# Altium schematic sheet triggerbox.SchDoc
size A3
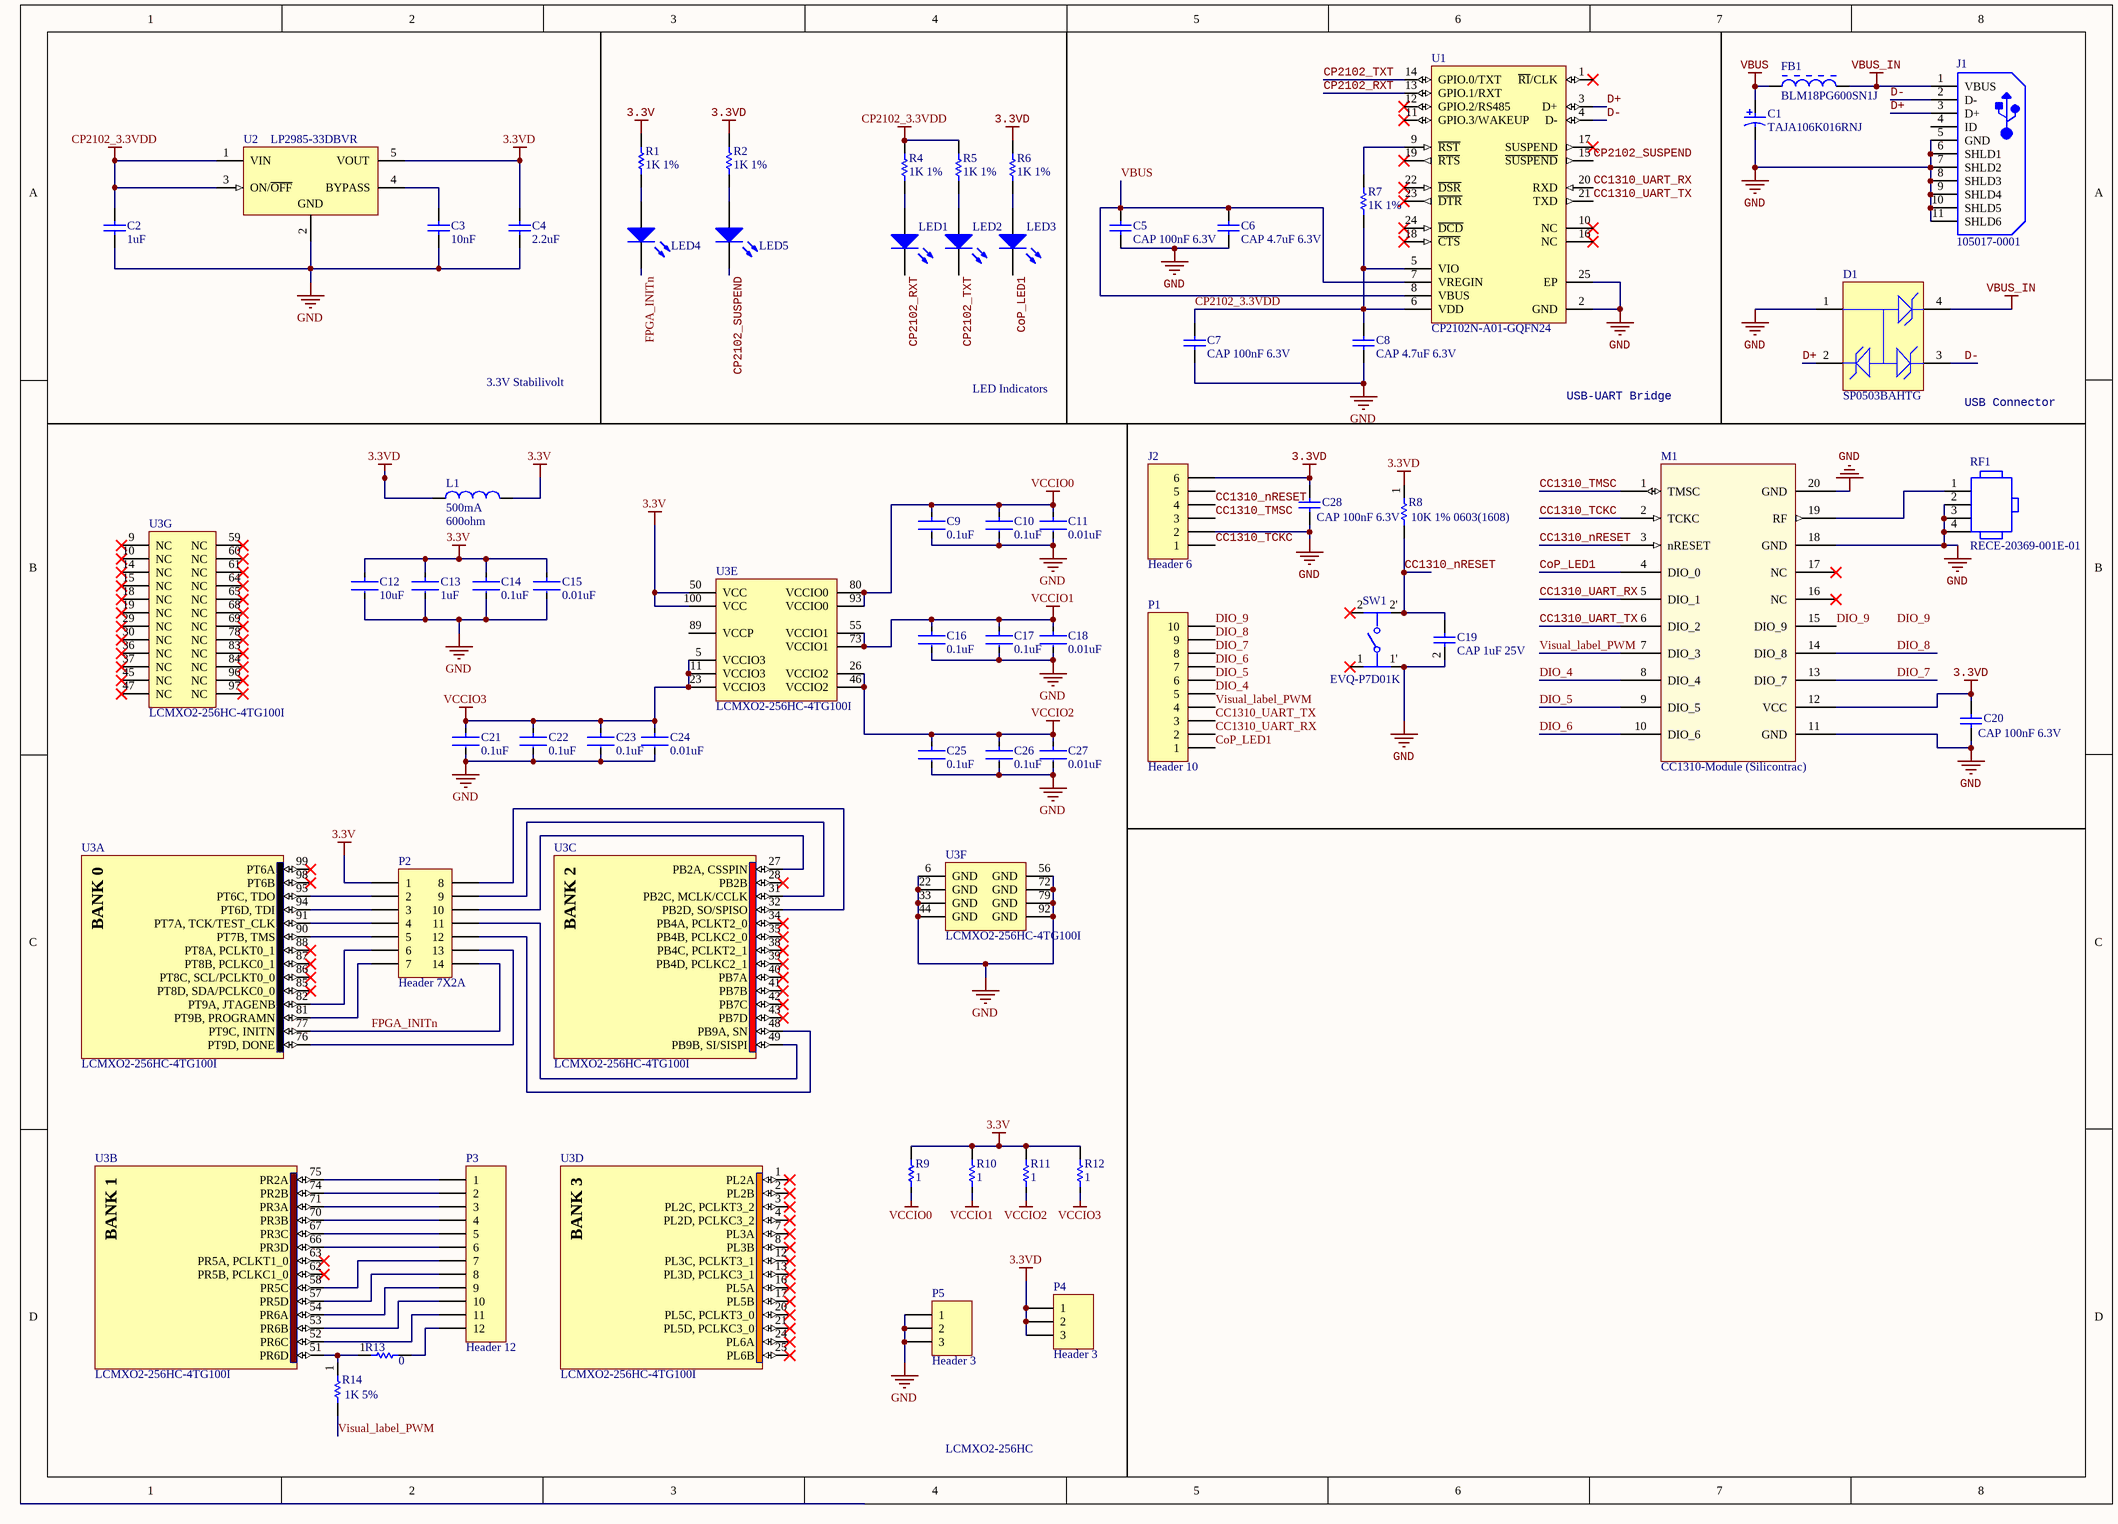
[diagram p0: triggerbox.SchDoc]

## Parts
C1  TAJA106K016RNJ  [CAPMP3217X18-T_V]
C2  1uF  [CAPC0603(1608)55_N]
C3  10nF  [CAPC0603(1608)55_N]
C4  2.2uF  [CAPC0603(1608)55_N]
C5  CAP 100nF 6.3V  [CAPC0603(1608)100_N]
C6  CAP 4.7uF 6.3V  [CAPC0603(1608)100_N]
C7  CAP 100nF 6.3V  [CAPC0603(1608)100_N]
C8  CAP 4.7uF 6.3V  [CAPC0603(1608)100_N]
C9  0.1uF  [FP-GRM155-0_05-IPC_A]
C10  0.1uF  [FP-GRM155-0_05-IPC_A]
C11  0.01uF  [FP-GRM155-0_05-IPC_A]
C12  10uF  [FP-GRM155-0_05-IPC_A]
C13  1uF  [FP-GRM155-0_05-IPC_A]
C14  0.1uF  [FP-GRM155-0_05-IPC_A]
C15  0.01uF  [FP-GRM155-0_05-IPC_A]
C16  0.1uF  [FP-GRM155-0_05-IPC_A]
C17  0.1uF  [FP-GRM155-0_05-IPC_A]
C18  0.01uF  [FP-GRM155-0_05-IPC_A]
C19  CAP 1uF 25V  [CAPC0603(1608)100_N]
C20  CAP 100nF 6.3V  [CAPC0603(1608)100_N]
C21  0.1uF  [FP-GRM155-0_05-IPC_A]
C22  0.1uF  [FP-GRM155-0_05-IPC_A]
C23  0.1uF  [FP-GRM155-0_05-IPC_A]
C24  0.01uF  [FP-GRM155-0_05-IPC_A]
C25  0.1uF  [FP-GRM155-0_05-IPC_A]
C26  0.1uF  [FP-GRM155-0_05-IPC_A]
C27  0.01uF  [FP-GRM155-0_05-IPC_A]
C28  CAP 100nF 6.3V  [CAPC0603(1608)100_N]
D1  SP0503BAHTG  [LFUS-SOT143-4_V]
FB1  BLM18PG600SN1J  [MURA-BLM18PG_KG-CHIP-2_V2]
J1  105017-0001  [USB-MICRO-B_V]
J2  Header 6  [GH-1.25-WS-6P]
L1  500mA  value 600ohm  [0402-A]
LED1  150060BS75000  [0603_A]  (value not drawn)
LED2  150060BS75000  [0603_A]  (value not drawn)
LED3  150060BS75000  [0603_A]  (value not drawn)
LED4  150060BS75000  [0603_A]  (value not drawn)
LED5  150060BS75000  [0603_A]  (value not drawn)
M1  CC1310-Module (Silicontrac)  [CC1310ZTR4-GC]
P1  Header 10  [HDR1X10]
P2  Header 7X2A  [HDR2X7_CEN]
P3  Header 12  [HDR1X12]
P4  Header 3  [HDR1X3]
P5  Header 3  [HDR1X3]
R1  1K 1%  [RESC0603(1608)_N]
R2  1K 1%  [RESC0603(1608)_N]
R4  1K 1%  [RESC0603(1608)_N]
R5  1K 1%  [RESC0603(1608)_N]
R6  1K 1%  [RESC0603(1608)_N]
R7  1K 1%  [RESC0603(1608)_N]
R8  10K 1% 0603(1608)  [RESC0603(1608)_N]
R9  1  [RESC0603(1608)_N]
R10  1  [RESC0603(1608)_N]
R11  1  [RESC0603(1608)_N]
R12  1  [RESC0603(1608)_N]
R13  0  [RESC0603(1608)_N]
R14  1K 5%  [RESC0603(1608)_N]
RF1  RECE-20369-001E-01  [IPEX_MHF_I]
SW1  EVQ-P7D01K  [FP-EVQ-P7D01K-MFG]
U1  CP2102N-A01-GQFN24  [SLAB-QFN-24-2550x2550TP_A_V]
U2  LP2985-33DBVR  [DBV0005A_M]
U3  LCMXO2-256HC-4TG100I  [TQFP100_N]  (parts A,B,C,D,E,F,G of 7)

## Nets
3.3V: C12.1 C13.1 C14.1 C15.1 L1.2 P2.1 R1.2 R9.2 R10.2 R11.2 R12.2 U3.50(VCC) U3.100(VCC)
3.3VD: C4.2 C20.2 C28.2 J2.6 L1.1 M1.12(VCC) P4.1 P4.2 P4.3 R2.2 R6.2 R8.1 U2.5(VOUT)
CP2102_3.3VDD: C2.2 C7.2 C8.2 R4.2 R5.2 R7.1 U1.5(VIO) U1.6(VDD) U2.1(VIN) U2.3(ON/~{OFF})
GND: C1.2 C2.1 C3.1 C4.1 C5.1 C6.1 C7.1 C8.1 C9.2 C10.2 C11.2 C12.2 C13.2 C14.2 C15.2 C16.2 C17.2 C18.2 C19.2 C20.1 C21.2 C22.2 C23.2 C24.2 C25.2 C26.2 C27.2 C28.1 D1.1 J1.5(GND) J1.6(SHLD1) J1.7(SHLD2) J1.8(SHLD3) J1.9(SHLD4) J1.10(SHLD5) J1.11(SHLD6) J2.2 M1.11(GND) M1.18(GND) M1.20(GND) P5.1 P5.2 P5.3 RF1.2 RF1.3 RF1.4 SW1.1' U1.2(GND) U1.25(EP) U2.2(GND) U3.6(GND) U3.22(GND) U3.33(GND) U3.44(GND) U3.56(GND) U3.72(GND) U3.79(GND) U3.92(GND)
VBUS: C1.1 C5.2 C6.2 FB1.1 U1.7(VREGIN) U1.8(VBUS)
VBUS_IN: D1.4 FB1.2 J1.1(VBUS)
VCCIO0: C9.1 C10.1 C11.1 R9.1 U3.80(VCCIO0) U3.93(VCCIO0)
VCCIO1: C16.1 C17.1 C18.1 R10.1 U3.55(VCCIO1) U3.73(VCCIO1)
VCCIO2: C25.1 C26.1 C27.1 R11.1 U3.26(VCCIO2) U3.46(VCCIO2)
VCCIO3: C21.1 C22.1 C23.1 C24.1 R12.1 U3.5(VCCIO3) U3.11(VCCIO3) U3.23(VCCIO3)
CC1310_nRESET: C19.1 J2.4 M1.3(nRESET) R8.2 SW1.2'
CC1310_TCKC: J2.1 M1.2(TCKC)
CC1310_TMSC: J2.3 M1.1(TMSC)
CC1310_UART_RX: M1.5(DIO_1) P1.2 U1.20(RXD)
CC1310_UART_TX: M1.6(DIO_2) P1.3 U1.21(TXD)
CoP_LED1: LED3.1(K) M1.4(DIO_0) P1.1
CP2102_RXT: LED1.1(K) U1.13(GPIO.1/RXT)
CP2102_SUSPEND: LED5.1(K) U1.15(~{SUSPEND})
CP2102_TXT: LED2.1(K) U1.14(GPIO.0/TXT)
D+: D1.2 J1.3(D+) U1.3(D+)
D-: D1.3 J1.2(D-) U1.4(D-)
DIO_4: M1.8(DIO_4) P1.5
DIO_5: M1.9(DIO_5) P1.6
DIO_6: M1.10(DIO_6) P1.7
DIO_7: M1.13(DIO_7) P1.8
DIO_8: M1.14(DIO_8) P1.9
DIO_9: M1.15(DIO_9) P1.10
FPGA_INITn: LED4.1(K) P2.14 U3.77(PT9C,_INITN)
Visual_label_PWM: M1.7(DIO_3) P1.4 R14.2
NetC3_2: C3.2 U2.4(BYPASS)
NetLED1_2: LED1.2(A) R4.1
NetLED2_2: LED2.2(A) R5.1
NetLED3_2: LED3.2(A) R6.1
NetLED4_2: LED4.2(A) R1.1
NetLED5_2: LED5.2(A) R2.1
NetM1_19: M1.19(RF) RF1.1
NetP2_2: P2.2 U3.95(PT6C,_TDO)
NetP2_3: P2.3 U3.94(PT6D,_TDI)
NetP2_4: P2.4 U3.91(PT7A,_TCK/TEST_CLK)
NetP2_5: P2.5 U3.90(PT7B,_TMS)
NetP2_6: P2.6 U3.82(PT9A,_JTAGENB)
NetP2_7: P2.7 U3.81(PT9B,_PROGRAMN)
NetP2_8: P2.8 U3.32(PB2D,_SO/SPISO)
NetP2_9: P2.9 U3.31(PB2C,_MCLK/CCLK)
NetP2_10: P2.10 U3.27(PB2A,_CSSPIN)
NetP2_11: P2.11 U3.49(PB9B,_SI/SISPI)
NetP2_12: P2.12 U3.48(PB9A,_SN)
NetP2_13: P2.13 U3.76(PT9D,_DONE)
NetP3_1: P3.1 U3.75(PR2A)
NetP3_2: P3.2 U3.74(PR2B)
NetP3_3: P3.3 U3.71(PR3A)
NetP3_4: P3.4 U3.70(PR3B)
NetP3_5: P3.5 U3.67(PR3C)
NetP3_6: P3.6 U3.66(PR3D)
NetP3_7: P3.7 U3.58(PR5C)
NetP3_8: P3.8 U3.57(PR5D)
NetP3_9: P3.9 U3.54(PR6A)
NetP3_10: P3.10 U3.53(PR6B)
NetP3_11: P3.11 U3.52(PR6C)
NetP3_12: P3.12 R13.2
NetR7_2: R7.2 U1.9(~{RST})
NetR13_1: R13.1 R14.1 U3.51(PR6D)

Not connected (* = marked no-connect by the designer): J1 4(ID); J2 5; M1 16(NC)* 17(NC)*; SW1 1* 2*; U1 1(~{RI}/CLK)* 10(NC)* 11(GPIO.3/WAKEUP)* 12(GPIO.2/RS485)* 16(NC)* 17(SUSPEND)* 18(~{CTS})* 19(~{RTS})* 22(~{DSR})* 23(~{DTR})* 24(~{DCD})*; U3 1(PL2A)* 2(PL2B)* 3(PL2C,_PCLKT3_2)* 4(PL2D,_PCLKC3_2)* 7(PL3A)* 8(PL3B)* 9(NC)* 10(NC)* 12(PL3C,_PCLKT3_1)* 13(PL3D,_PCLKC3_1)* 14(NC)* 15(NC)* 16(PL5A)* 17(PL5B)* 18(NC)* 19(NC)* 20(PL5C,_PCLKT3_0)* 21(PL5D,_PCLKC3_0)* 24(PL6A)* 25(PL6B)* 28(PB2B)* 29(NC)* 30(NC)* 34(PB4A,_PCLKT2_0)* 35(PB4B,_PCLKC2_0)* 36(NC)* 37(NC)* 38(PB4C,_PCLKT2_1)* 39(PB4D,_PCLKC2_1)* 40(PB7A)* 41(PB7B)* 42(PB7C)* 43(PB7D)* 45(NC)* 47(NC)* 59(NC)* 60(NC)* 61(NC)* 62(PR5B,_PCLKC1_0)* 63(PR5A,_PCLKT1_0)* 64(NC)* 65(NC)* 68(NC)* 69(NC)* 78(NC)* 83(NC)* 84(NC)* 85(PT8D,_SDA/PCLKC0_0)* 86(PT8C,_SCL/PCLKT0_0)* 87(PT8B,_PCLKC0_1)* 88(PT8A,_PCLKT0_1)* 89(VCCP) 96(NC)* 97(NC)* 98(PT6B)* 99(PT6A)*

## Notes on the sheet
- 3.3V Stabilivolt
- LED Indicators
- USB-UART Bridge
- USB Connector
- LCMXO2-256HC
- Labels drawn without touching a wire or pin: DIO_9
- (in symbol CMP-0111-00366-1, part A) BANK 0
- (in symbol CMP-0111-00366-1, part B) BANK 1
- (in symbol CMP-0111-00366-1, part C) BANK 2
- (in symbol CMP-0111-00366-1, part D) BANK 3

## Library data of the parts
C1 = CMP-1661-00004-1: Standard Tantalum, 10 uF, +/- 10%, 16 V, -55 to 125 degC, 2-Pin SMD (1206), RoHS, Tape and Reel; Frequency: 300 MHz; Vce Max: 500 mV; hFE Min: 60; Elements: 2; Case\Package: SOT-26; Max Power Dissipation: 300 mW; Min Operating Temperature: -55 degC; Width: 1.7 mm; ComponentLink2URL: http://datasheets.avx.com/TAJ.pdf; PackageDescription: 2-Pin Surface Mount Device, Body 3.2 x 1.65 mm; RoHSCompliant: true; ComponentLink2Description: Datasheet; Package Quantity: 3000; Max Operating Temperature: 150 degC; Length: 3.1 mm; Mount: Surface Mount; Packaging: Tape and Reel; ComponentLink1URL: http://www.avx.com/; ComponentLink1Description: Manufacturer URL; DatasheetVersion: Feb-16; ComponentLink3URL: http://www.avx.com/download/software/literature/AVX-Footprint-Library.pdf; ComponentLink3Description: Package Specification; Height: 1.3 mm; PackageReference: CAPMP3217X18-T; REACH SVHC: No SVHC; Pins: 6; Radiation Hardening: No
C2-C4 = CMP-1035-02786-1: CAP 4.7uF 10V ±20% 0603 (1608 Metric) Thickness 0.55mm SMD; Tolerance: Â±20%; Case-EIA: 0603; Case-Metric: 1608; Technology: SMT; Max Thickness: 0.55 mm; Rated Voltage: 10 V; Value: 4.7uF
C5 C7 = CMP-1035-02575-1: CAP 100nF 6.3V ±5% 0603 (1608 Metric) Thickness 1mm SMD; Tolerance: Â±5%; Case-Metric: 1608; Case-EIA: 0603; Technology: SMT; Rated Voltage: 6.3 V; Max Thickness: 1 mm; Value: 100nF
C6 C8 = CMP-1035-02782-1: CAP 4.7uF 6.3V ±20% 0603 (1608 Metric) Thickness 1mm SMD; Case-EIA: 0603; Tolerance: Â±20%; Case-Metric: 1608; Technology: SMT; Rated Voltage: 6.3 V; Max Thickness: 1 mm; Value: 4.7uF
C9 C10 C12-C17 C21-C23 C25 C26 = CMP-2008-04561-5: CAP CER 0.1UF 10V X5R 0402; Tolerance: 10%; Capacitance: 220nF; Material: Ceramic; Insulation Resistance: 10GR; Package Quantity: 1; Termination: SMD/SMT; Max Operating Temperature: 85°C; Voltage: 10V; REACH SVHC: No SVHC; Thickness: 0.022inch; Mount: Surface Mount; Height: 0.5mm; Length: 1mm; Lead Free: Lead Free; Number of Pins: 2; Case Code (Imperial): 0402; Case/Package: 0402; Min Operating Temperature: -55°C; Packaging: Tape and Reel; Dielectric: X5R; Depth: 0.5mm; Series: GRM; Case Code (Metric): 1005; Radiation Hardening: No; RoHS Compliant: Yes; Voltage Rating (DC): 10V; Voltage Rating: 10V; Dielectric Material: Ceramic; Width: 0.5mm
C11 C18 C24 C27 = CMP-2008-04561-5: CAP CER 0.01UF 10V X5R 0402; Tolerance: 10%; Capacitance: 220nF; Material: Ceramic; Insulation Resistance: 10GR; Package Quantity: 1; Termination: SMD/SMT; Max Operating Temperature: 85°C; Voltage: 10V; REACH SVHC: No SVHC; Thickness: 0.022inch; Mount: Surface Mount; Height: 0.5mm; Length: 1mm; Lead Free: Lead Free; Number of Pins: 2; Case Code (Imperial): 0402; Case/Package: 0402; Min Operating Temperature: -55°C; Packaging: Tape and Reel; Dielectric: X5R; Depth: 0.5mm; Series: GRM; Case Code (Metric): 1005; Radiation Hardening: No; RoHS Compliant: Yes; Voltage Rating (DC): 10V; Voltage Rating: 10V; Dielectric Material: Ceramic; Width: 0.5mm
C19 = CMP-1035-02741-1: CAP 1uF 25V ±20% 0603 (1608 Metric) Thickness 1mm SMD; Tolerance: Â±20%; Case-EIA: 0603; Case-Metric: 1608; Max Thickness: 1 mm; Technology: SMT; Rated Voltage: 25 V; Value: 1uF
C20 C28 = CMP-1035-02576-1: CAP 100nF 6.3V ±10% 0603 (1608 Metric) Thickness 1mm SMD; Tolerance: Â±10%; Case-Metric: 1608; Case-EIA: 0603; Max Thickness: 1 mm; Value: 100nF; Rated Voltage: 6.3 V; Technology: SMT
D1 = CMP-2000-05191-1: TVS Diode Array, 30 pF, 30 KV, -40 to 85 degC, 4-Pin SOT143, RoHS, Tape and Reel; Manufacturer: Littelfuse; Direction Type: Uni-Directional; Product Height (mm): 1.05mm; Leakage Current (Max): 0.1uA; Clamping Voltage (Max): 8V; Reverse Stand-off Voltage: 5.5(Min)V; Configuration: Triple; Working Voltage: 5.5V; Product Length (mm): 3.04mm; Working Voltage (Max): 5.5V(Min); Capacitance Value: 30pF; Rad Hardened: No; Number of Elements: 3; Product Depth (mm): 1.4mm; Operating Temperature Max Deg. C: 85C; Suppressor Type: TVS; Operating Temperature Min Deg. C: -40C; Operating Temp Range: -40Cto85C; Mounting: SurfaceMount; Package / Case: SOT-143; Datasheet Version: Dec-13; Package Type: SOT-143; Packaging: TapeandReel; Pin Count: 3+Tab; Operating Temperature Classification: Industrial; Datasheet URL: https://datasheet.ciiva.com/15143/getdatasheetpartid-116020-15143550.pdf; Manufacturer URL: http://www.littelfuse.com/; Leakage Current: 0.1uA; Mounting Style: SurfaceMount; Clamping Voltage: 8V; Polarity: Uni-Directional
FB1 = CMP-0686-00574-2: Chip Ferrite Bead for Power Lines, 60 Ohm, 500 mA, -55 to 125 degC, 1.6 x 0.8 x 0.95 mm SMD, Tape and Reel; Manufacturer: Murata; Impedance (at 100 MHz): 60 Ohm Typ.; Rated Current: 500 mA; DC Resistance: 0.10 Ohm Max.; ComponentLink2URL: http://www.murata.com/products/catalog/pdf/c31e.pdf; ComponentLink1Description: Manufacturer URL; Operating Temperature Range: -55 to 125 degC; DatasheetVersion: 08/2013; PackageDescription: 2-Pin Chip, Body 1.6 x 0.8 mm; PackageReference: BLM18_H950-2; ComponentLink2Description: Datasheet; PartNumber: BLM18PG600SN1J; Mounting Technology: Surface Mount; ComponentLink3URL: http://www.murata.com/products/catalog/pdf/c31e.pdf; ComponentLink3Description: Package Specification; Packing: Tape and Reel; ComponentLink1URL: http://www.murata.com/
J1 = CMP-2000-05827-1: Micro-USB B Receptacle, Right Angle, Bottom Mount, Surface Mount, with Solder Tabs, -30 to 85 degC, 5-Pin USB, RoHS, Tape and Reel; Manufacturer: Molex; Featured Product: Micro-USBConnectorsUSBConnectors; Other Names: WM1399DKR; Package Version: Rev. F, 12/2012; Number of Contacts: 5; Connector Type: USB-microB; Catalog Drawings: 1050170001; 3D Model: 105017-0001.stp; Mating Products: WM17145-ND-CABLEMICROUSBBTOSTDA1.0MWM17147-ND-CABLEMICROUSBBTOSTDA2.0MWM17146-ND-CABLEMICROUSBBTOSTDA1.5M; PCN Assembly/Origin: ResinSupplier21/Oct/2015; Voltage - Max: 30V; Online Catalog: Molex-MicroUSB; Manufacturer URL: http://www.molex.com/; Package Description: 5-Leads USB, Micro B, Body 7.5 x 5 mm, Pitch 0.65 mm; Datasheet URL: http://www.molex.com/elqNow/elqRedir.htm?ref=http://www.molex.com/webdocs/datasheets/pdf/en-us/1050170001_IO_CONNECTORS.pdf; Ingress Protection: -; Datasheet Version: 03/2016; Mounting Type: BoardCutout,SurfaceMount,RightAngle; Circuits: 5; Standard Package: 1; Package Reference: MICRO-B; Package URL: http://www.molex.com/pdm_docs/sd/1050170001_sd.pdf; Category: Connectors,Interconnects; Series: -; RoHS Information: 1050170001CertofCompliance; Features: Shielded,SolderRetention; Family: USB,DVI,HDMIConnectors; Specifications: -; Gender: Receptacle; Packaging: Digi-Reel®; Mounting Technology: SurfaceMount
J2 = Header 6: Header, 6-Pin; LatestRevisionDate: 17-Jul-2002; LatestRevisionNote: Re-released for DXP Platform.; Publisher: Altium Limited
L1 = Inductor: Code_IEC: 1005; Published: 8-Jun-2000; LatestRevisionDate: 29-May-2009; LatestRevisionNote: IPC-7351 Footprint Added.; PackageReference: 0402-A; Publisher: Altium Limited; PackageDescription: Chip Inductor; Code_JEITA: 0402
LED1-LED5 = CMP-1426-00003-1: SMD mono-color Chip LED, WL-SMCW, Blue; Manufacturer: Wuerth Elektronik; Color: Blue; ComponentLink2Description: Datasheet; ComponentLink2URL: http://katalog.we-online.com/led/datasheet/150060BS75000.pdf; ComponentLink1URL: http://www.we-online.com; PackageReference: 0603_A; PartNumber: 150060BS75000; ComponentLink1Description: Manufacturer URL
M1 = CC1310-MOD
P1 = Header 10: Header, 10-Pin; LatestRevisionDate: 17-Jul-2002; LatestRevisionNote: Re-released for DXP Platform.; Publisher: Altium Limited
P2 = Header 7X2A: Header, 7-Pin, Dual row; LatestRevisionDate: 17-Jul-2002; LatestRevisionNote: Re-released for DXP Platform.; Publisher: Altium Limited
P3 = Header 12: Header, 12-Pin; LatestRevisionDate: 17-Jul-2002; LatestRevisionNote: Re-released for DXP Platform.; Publisher: Altium Limited
P4 P5 = Header 3: Header, 3-Pin; LatestRevisionDate: 17-Jul-2002; LatestRevisionNote: Re-released for DXP Platform.; Publisher: Altium Limited
R1 R2 R4-R6 R9-R12 = CMP-1012-00510-1: 1K 0.1W 1% 0603 (1608 Metric)  SMD; Case-Metric: 1608; Case-EIA: 0603; Value: 1000.00 Ohm; Technology: SMT; Tolerance: 1 %; Power: 0.1 W
R7 = CMP-1012-00510-1: 1K 0.1W 1% 0603 (1608 Metric)  SMD; Manufacturer: Vishay Dale; Manufacturer Part Number: CRCW06031K00FKEB; Manufacturer Part Number: CRCW06031K00FKTA; Manufacturer: Yageo; Manufacturer Part Number: RC0603FR-071KL; Manufacturer Part Number: CRCW06031K00FKEC; Manufacturer Part Number: CRCW06031K00FKTB; Manufacturer: Bourns; Manufacturer Part Number: CR0603-FX-1001ELF; Manufacturer: Panasonic; Manufacturer Part Number: ERJ3EKF1001V; Manufacturer Part Number: CRCW06031K00FKEA; Case-Metric: 1608; Case-EIA: 0603; Value: 1000.00 Ohm; Technology: SMT; Tolerance: 1 %; Power: 0.1 W
R8 R13 R14 = CMP-1012-00623-1: 10K 0.1W 1% 0603 (1608 Metric)  SMD; Value: 10000.00 Ohm; Case-EIA: 0603; Case-Metric: 1608; Power: 0.1 W; Tolerance: 1 %; Technology: SMT
RF1 = TG-RECE-20369-001E-01-4: RF Connector, Onboard Receptacle, IPEX MHFIII; Manufacturer: Taoglas; Packing: Tape and Reel; Mounting Technology: Surface Mount; PackageReference: RECE-20369-001E-01-4; Housing Color: Gold; ComponentLink2URL: http://www.taoglas.com/images/product_images/original_images/RECE.20369.001E.01.pdf; ComponentLink3Description: Package Specification; PackageDescription: 4-Pin, Hand Drawn, Body 1.7x1.7mm; DatasheetVersion: Rev. C; ComponentLink1Description: Manufacturer URL; ComponentLink2Description: Datasheet; ComponentLink1URL: http://www.taoglas.com/; PartNumber: RECE-20369-001E-01; ComponentLink3URL: http://www.taoglas.com/images/product_images/original_images/RECE.20369.001E.01.pdf; PackageVersion: Rev. C
SW1 = CMP-05618-000102-1: SWITCH TACTILE SPST-NO 0.05A 12V; Max Current Rating: 50mA; Throw Configuration: SPST; Switch Function: Off-Mom; Contact Resistance: 500mR; Operating Force: 2.2N; Illumination Type: Non-Illuminated; Electrical Life: 100000Cycles; Actuator Color: Black; Actuator Length: 0.65mm; Switch Travel: 0.2mm; Min Operating Temperature: -20°C; Packaging: Tape and Reel; Orientation: Right Angle; Contact Current Rating: 50mA; Radiation Hardening: No; Length: 4.3mm; Current Rating: 50mA; Max Operating Temperature: 70°C; Mount: Surface Mount; Voltage Rating (DC): 12V; Max Voltage Rating (DC): 12V; Size: 2.9mm; Termination: J-Bend; Depth: 3.55mm; Series: EVQP7; Mechanical Life: 100000Cycles; Lead Free: Lead Free; REACH SVHC: No SVHC; Package Quantity: 1
U1 = SLAB-CP2102N-QFN-24: USBXpress(TM) Family, 4 GPIOs, 2.2 to 3.6 V, -40 to 85 degC, 24-Pin QFN, RoHS; Manufacturer: Silicon Labs; Max Supply Voltage: 3.6V; Min Supply Voltage: 3V; Datasheet Version: Rev. 1.1, 08/2016; Max Operating Temperature: 85degC; Case\/Package: QFN; Number of Pins: 24; Min Operating Temperature: -40degC; Mounting Technology: SurfaceMount; Manufacturer URL: http://www.silabs.com/; RoHSCompliant: False; Package Reference: QFN-24-2550x2550TP_A; Datasheet URL: http://www.silabs.com/documents/public/data-sheets/cp2102n-datasheet.pdf; Package Description: 24-Pin Quad Flat No-lead Package, Body 4 x 4 mm, Pitch 0.5 mm; REACH SVHC: Unknown
U2 = CMP-0758-00080-2: Single Output Low Noise LDO, 150 mA, Fixed 3.3 V Output, 1.5% Tolerance, 2.2 to 16 V Input, Low IQ, 5-Pin SOT-23 (DBV), -40 to 125 degC, Green (RoHS & no Sb/Br), Tape and Reel; Manufacturer: Texas Instruments; Vdo (Typ) (mV): 280; Accuracy (%): 1.5; Output Options: Fixed Output; Fixed Output Options (V): 3.3; Iout (Max) (A): 0.15; Iq (Typ) (mA): 0.85; ComponentLink3Description: Package Specification; Packing: Tape and Reel; ComponentLink3URL: http://www.ti.com/litv/pdf/mpds018j; Vin (V): 2.2 to 16; Mounting Technology: Surface Mount; ComponentLink1URL: http://www.ti.com/; PartNumber: LP2985-33DBVR; PackageReference: DBV0005A; ComponentLink2URL: http://www.ti.com/lit/ds/symlink/lp2985-50.pdf; RoHS: TRUE; ComponentLink2Description: Datasheet; PackageVersion: 4073253-4/L; Operating Temperature Range (degC): -40 to 125; DatasheetVersion: SLVS522N; ComponentLink1Description: Manufacturer URL; PackageDescription: 5-Pin Plastic Small Outline, Body 2.9 x 1.6 mm, Pitch 0.95 mm
U3 = CMP-0111-00366-1: MachXO2 High Performance CPLD with 256 LUTs, Voltage Regulator, 2.5V/3.3V, 100-pin TQFP, Speed Grade-4, Industrial Grade, Halogen Free (RoHS); PackageDescription: 100-Pin Thin Quad Flat Pack (TQFP100); PackageReference: TQFP100; DatasheetVersion: ver01.0, Nov-2010; Code_JEDEC: MS-026-BED; PackageVersion: ver02.6, Nov-2010